# EasyEDA Pro project ProPrj_MBC1  FRAM（AM29F016）(定稿)_2024-09-28.epro, schematic Schematic1
Create Date: 2023-07-10; Page Name: P1; Project Name: MBC1 （AM29F016）; Schematic Name: Schematic1; Update Date: 2024-05-26; Company: 嘉立创EDA; Page Size: A4; Version: V1.0
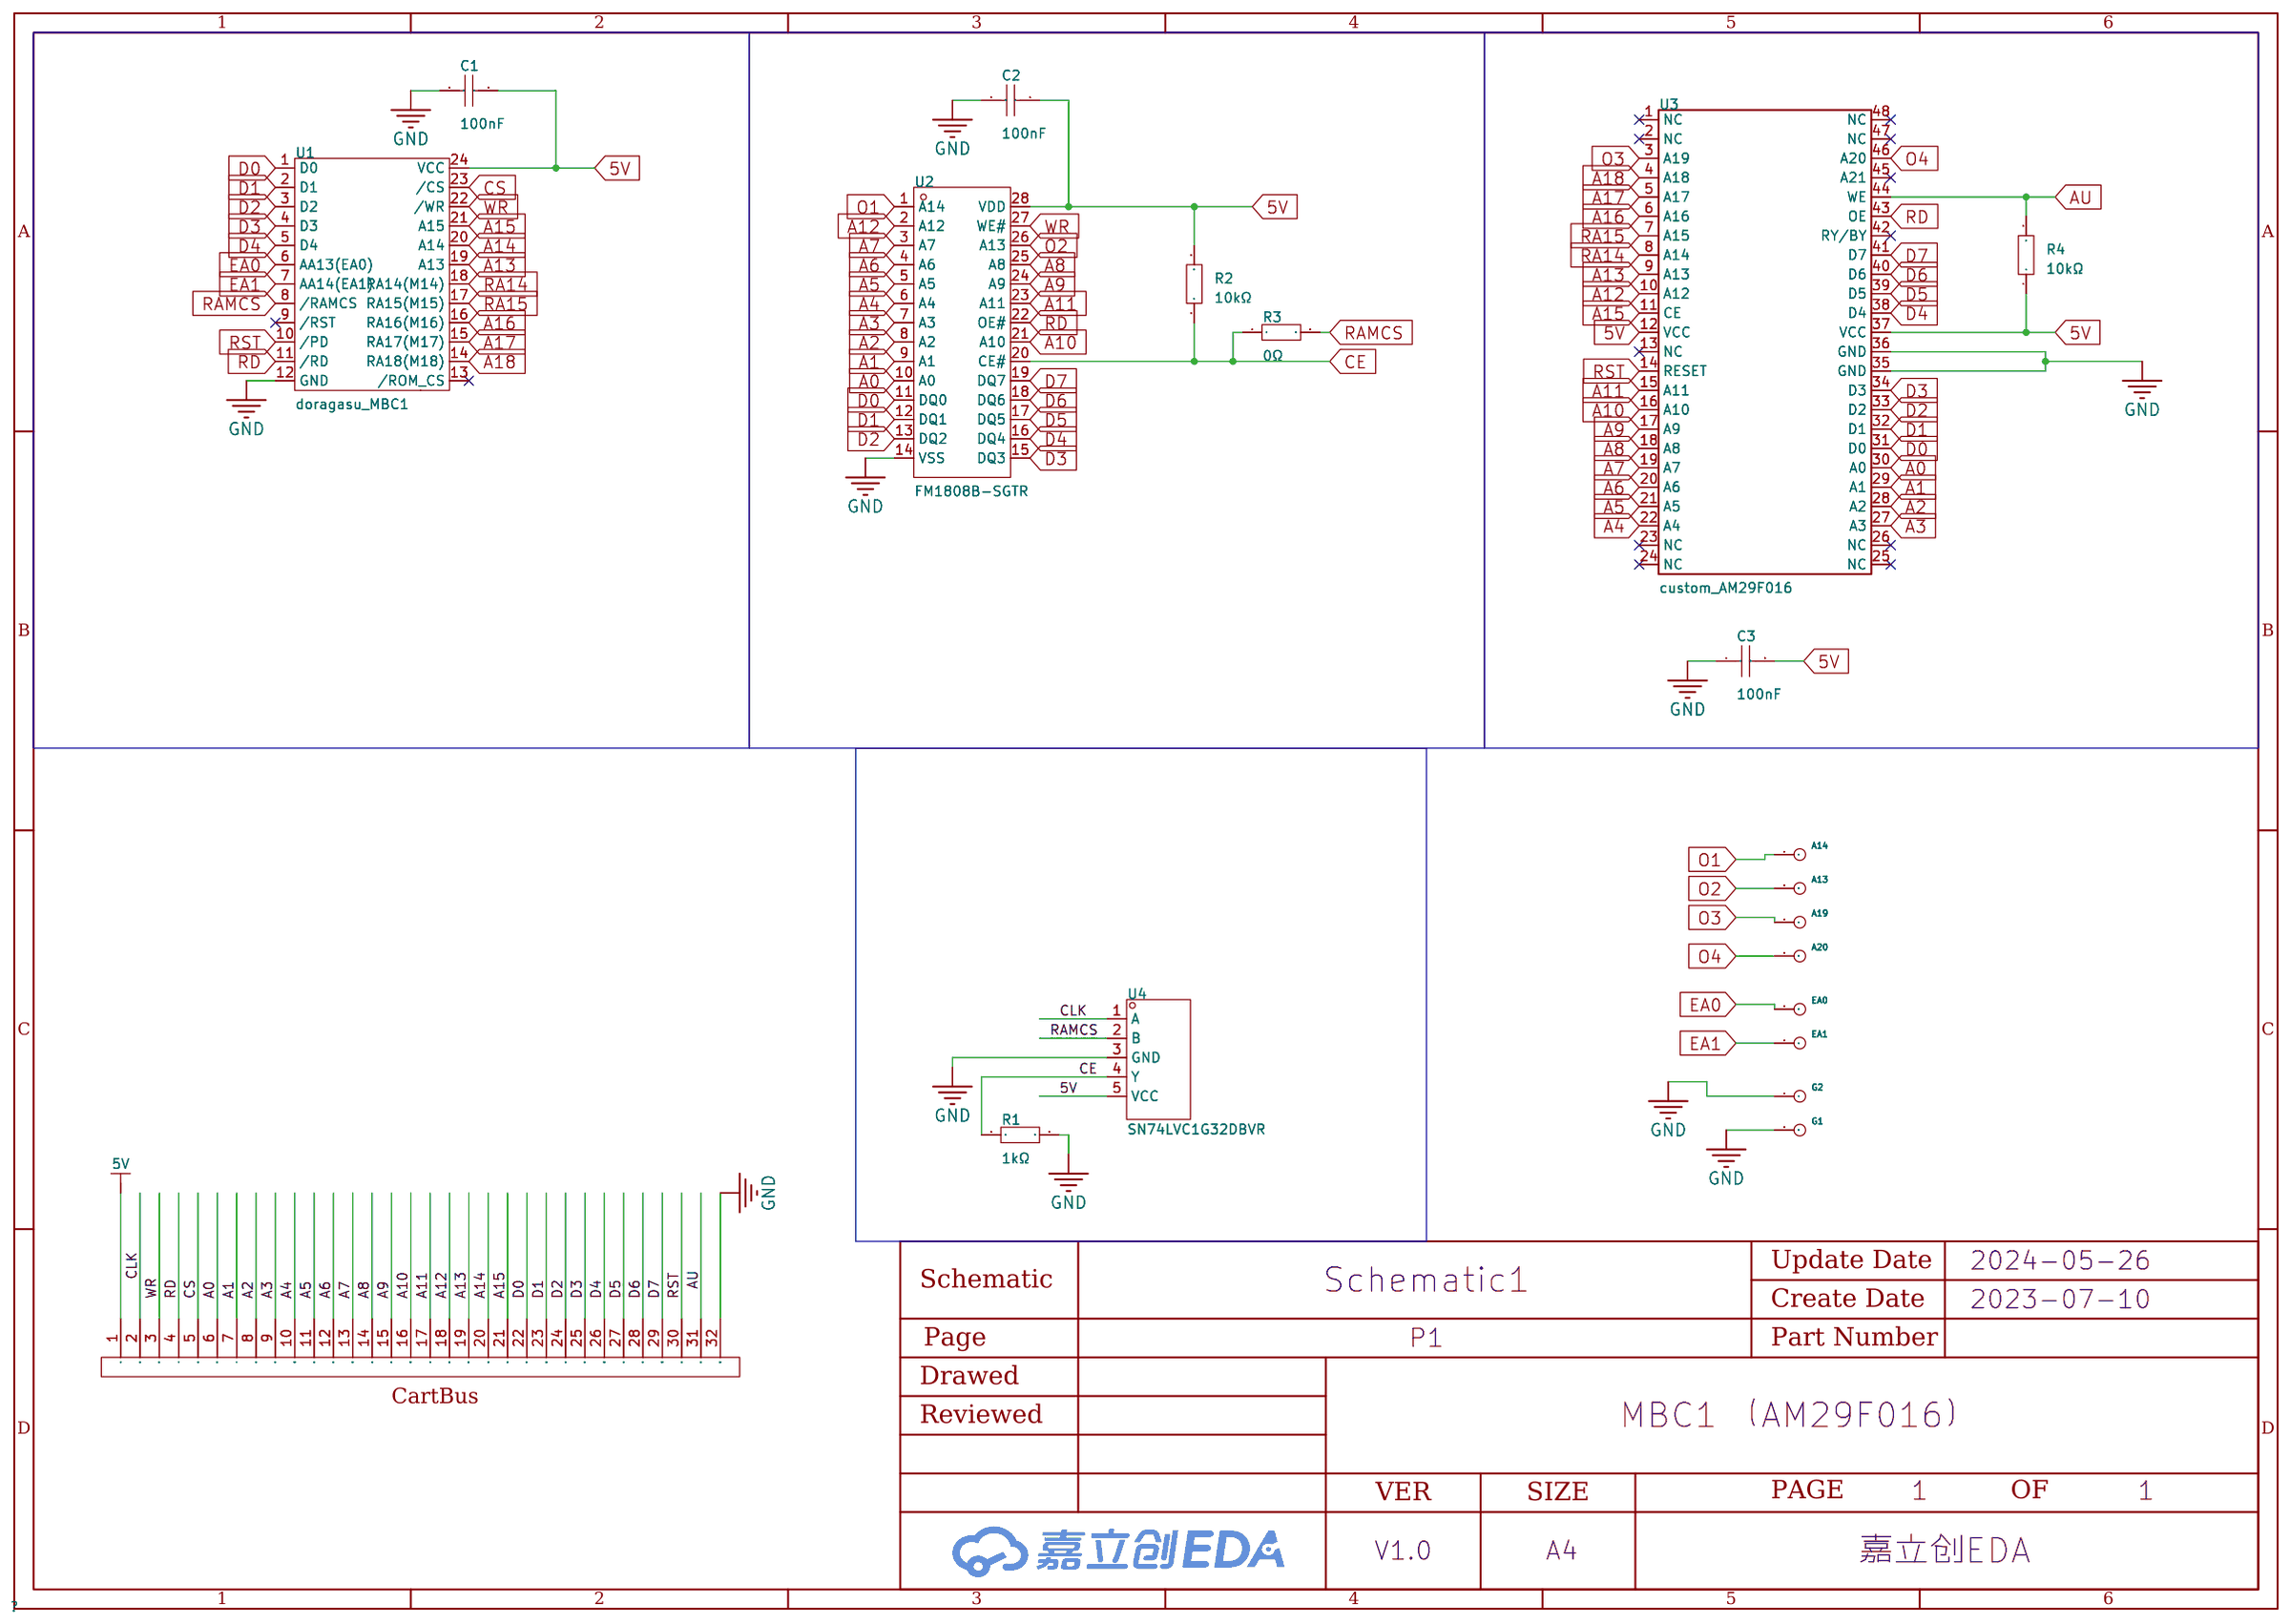
[diagram p0: schematic sheet]

## Parts
A13  Battery_Positive_After_Resistor  [test_1p]
A14  RTC_VOUT  [test_1p]
A19  Battery_Positive  [test_1p]
A20  Ground  [test_1p]
C1  100nF  [C0603]
C2  100nF  [C0603]
C3  100nF  [C0603]
EA0  Battery_Positive  [test_1p]
EA1  Ground  [test_1p]
G1  Ground  [test_1p]
G2  Battery_Positive  [test_1p]
R1  1kΩ  [R0603]
R2  10kΩ  [R0603]
R3  0Ω  [R0603]
R4  10kΩ  [R0603]
U1  MBC1  [MemoryBC1:SOIC-24 W_7.5x15.4mm_P1.27mm]
U2  FM1808B-SGTR  [SOIC-28_L17.9-W7.5-P1.27-LS10.3-BL]
U3  AM29F016  [Package_SO:TSOP-I-48_18.4x12mm_P0.5mm]
U4  SN74LVC1G32DBVR  [SOT-23-5_L3.0-W1.7-P0.95-LS2.8-BR]
U6  -  [gbgba cartbus]

## Library data of the parts
A13 A14 A19 A20 EA0 EA1 G1 G2 = Connector_TestPoint
C1-C3 = 0603B104K500NT: 容值:100nF;精度:±10%;额定电压:50V;材质(温度系数):X7R;; LCSC Part Name: 100nF ±10% 50V; Supplier Part: C30926; Manufacturer: FH(风华); Supplier Footprint: 0603; JLCPCB Part Class: 扩展库; Datasheet: https://atta.szlcsc.com/upload/public/pdf/source/20170923/C30926_1506149436298988724.pdf; Supplier: LCSC; Tolerance: ±10%; Voltage Rated: 50V; Temperature Coefficient: X7R
R1 = 0603WAF1001T5E: 电阻类型:厚膜电阻;阻值:1kΩ;精度:±1%;功率:100mW;; LCSC Part Name: 1kΩ ±1% 100mW; Supplier Part: C21190; Manufacturer: UNI-ROYAL(厚声); Supplier Footprint: 0603; JLCPCB Part Class: 基础库; Datasheet: https://atta.szlcsc.com/upload/public/pdf/source/20200306/C422600_1E6D84923E4A46A82E41ADD87F860B5C.pdf; Supplier: LCSC; Type: 厚膜电阻; Tolerance: ±1%; Power(Watts): 100mW; Temperature Coefficient: ±100ppm/℃; Overload Voltage (Max): 75V; Operating Temperature Range: -55℃~+155℃
R2 R4 = 0603WAF1002T5E: 电阻类型:厚膜电阻;阻值:10kΩ;精度:±1%;功率:100mW;; LCSC Part Name: 厚膜电阻 10kΩ ±1% 100mW; Supplier Part: C25804; Manufacturer: UNI-ROYAL(厚声); Supplier Footprint: 0603; JLCPCB Part Class: 基础库; Datasheet: https://atta.szlcsc.com/upload/public/pdf/source/20200306/C422600_1E6D84923E4A46A82E41ADD87F860B5C.pdf; Supplier: LCSC; Type: 厚膜电阻; Tolerance: ±1%; Power(Watts): 100mW; Temperature Coefficient: ±100ppm/℃; Overload Voltage (Max): 75V; Operating Temperature Range: -55℃~+155℃
R3 = 0603WAF0000T5E: 电阻类型:厚膜电阻;阻值:0Ω;精度:±1%;功率:100mW;; LCSC Part Name: 0Ω ±1% 100mW; Supplier Part: C21189; Manufacturer: UNI-ROYAL(厚声); Supplier Footprint: 0603; JLCPCB Part Class: 基础库; Datasheet: https://atta.szlcsc.com/upload/public/pdf/source/20200306/C422600_1E6D84923E4A46A82E41ADD87F860B5C.pdf; Supplier: LCSC; Type: 厚膜电阻; Tolerance: ±1%; Power(Watts): 100mW; Overload Voltage (Max): 75V; Operating Temperature Range: -55℃~+155℃
U1 = MemoryBC1: JLCPCB Part Class: 扩展库
U2 = FM1808B-SGTR_C2952340: Supplier Part: C2952340; Manufacturer: CYPRESS(赛普拉斯); Supplier Footprint: SOIC-28; JLCPCB Part Class: 扩展库; Supplier: LCSC
U3 = AM29F016
U4 = SN74LVC1G32DBVR: 逻辑电路的归属系列:74LVC;逻辑类型:或门;通道数:1;每通道输入数:2;电源电压:1.65V~5.5V;静态电流(最大值):10uA;; LCSC Part Name: 或门; Supplier Part: C10096; Manufacturer: TI(德州仪器); Supplier Footprint: SOT-23-5; JLCPCB Part Class: 扩展库; Datasheet: https://atta.szlcsc.com/upload/public/pdf/source/20121128/1457706565821.pdf; Supplier: LCSC; Series: 74LVC; Logic Type: 或门; number of channels: 1; Number of inputs per channel: 2; Supply Voltage(Single): 1.65V~5.5V; Quiescent Current (Max): 10uA; Max Propagation Delay @ V, Max CL: 4ns@5V,50pF; Low Level Output Current: 32mA; Hight Level Output Current: 32mA; Logical Level - High: 1.7V~2V; Logical Level - low: 0.7V~0.8V; Operating Temperature: -40℃~+125℃
U6 = GB GBA CartBus

## Nets
5V: C1.2 C2.2 C3.2 R2.2 R4.1 U1.24(VCC) U2.28(VDD) U3.12(VCC) U3.37(VCC) U4.5(VCC) U6.1
GND: C1.1 C2.1 C3.1 G1.1 G2.1 R1.2 U1.12(GND) U2.14(VSS) U3.35(GND) U3.36(GND) U4.3(GND) U6.32
A0: U2.10(A0) U3.30(A0) U6.6
A1: U2.9(A1) U3.29(A1) U6.7
A2: U2.8(A2) U3.28(A2) U6.8
A3: U2.7(A3) U3.27(A3) U6.9
A4: U2.6(A4) U3.22(A4) U6.10
A5: U2.5(A5) U3.21(A5) U6.11
A6: U2.4(A6) U3.20(A6) U6.12
A7: U2.3(A7) U3.19(A7) U6.13
A8: U2.25(A8) U3.18(A8) U6.14
A9: U2.24(A9) U3.17(A9) U6.15
A10: U2.21(A10) U3.16(A10) U6.16
A11: U2.23(A11) U3.15(A11) U6.17
A12: U2.2(A12) U3.10(A12) U6.18
A13: U1.19(A13) U3.9(A13) U6.19
A14: U1.20(A14) U6.20
A15: U1.21(A15) U3.11(CE) U6.21
A16: U1.16(RA16(M16)) U3.6(A16)
A17: U1.15(RA17(M17)) U3.5(A17)
A18: U1.14(RA18(M18)) U3.4(A18)
AU: R4.2 U3.44(WE) U6.31
CE: R1.1 R2.1 R3.1 U2.20(CE#) U4.4(Y)
CLK: U4.1(A) U6.2
CS: U1.23(/CS) U6.5
D0: U1.1(D0) U2.11(DQ0) U3.31(D0) U6.22
D1: U1.2(D1) U2.12(DQ1) U3.32(D1) U6.23
D2: U1.3(D2) U2.13(DQ2) U3.33(D2) U6.24
D3: U1.4(D3) U2.15(DQ3) U3.34(D3) U6.25
D4: U1.5(D4) U2.16(DQ4) U3.38(D4) U6.26
D5: U2.17(DQ5) U3.39(D5) U6.27
D6: U2.18(DQ6) U3.40(D6) U6.28
D7: U2.19(DQ7) U3.41(D7) U6.29
EA0: EA0.1 U1.6(AA13(EA0))
EA1: EA1.1 U1.7(AA14(EA1))
O1: A14.1 U2.1(A14)
O2: A13.1 U2.26(A13)
O3: A19.1 U3.3(A19)
O4: A20.1 U3.46(A20)
RA14: U1.18(RA14(M14)) U3.8(A14)
RA15: U1.17(RA15(M15)) U3.7(A15)
RAMCS: R3.2 U1.8(/RAMCS) U4.2(B)
RD: U1.11(/RD) U2.22(OE#) U3.43(OE) U6.4
RST: U1.10(/PD) U3.14(RESET) U6.30
WR: U1.22(/WR) U2.27(WE#) U6.3

Not connected (* = marked no-connect by the designer): U1 9(/RST)* 13(/ROM_CS)*; U3 1(NC)* 2(NC)* 13(NC)* 23(NC)* 24(NC)* 25(NC)* 26(NC)* 42(RY/BY)* 45(A21)* 47(NC)* 48(NC)*
